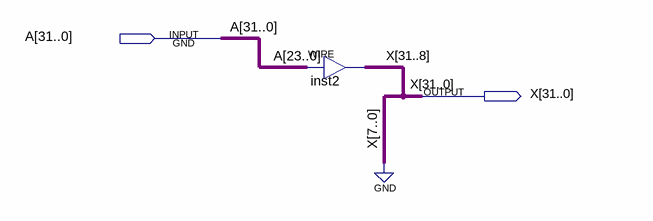
[diagram p0: schematic sheet]
// Quartus schematic shft8l32.bdf as structural Verilog: 1 symbols, 2 pins
module shft8l32 (
  input  [31:0] A,
  output [31:0] X
);

  assign X[31:8] = A[23:0];  // WIRE inst2

  assign X[7:0] = {8{1'b0}};
endmodule
